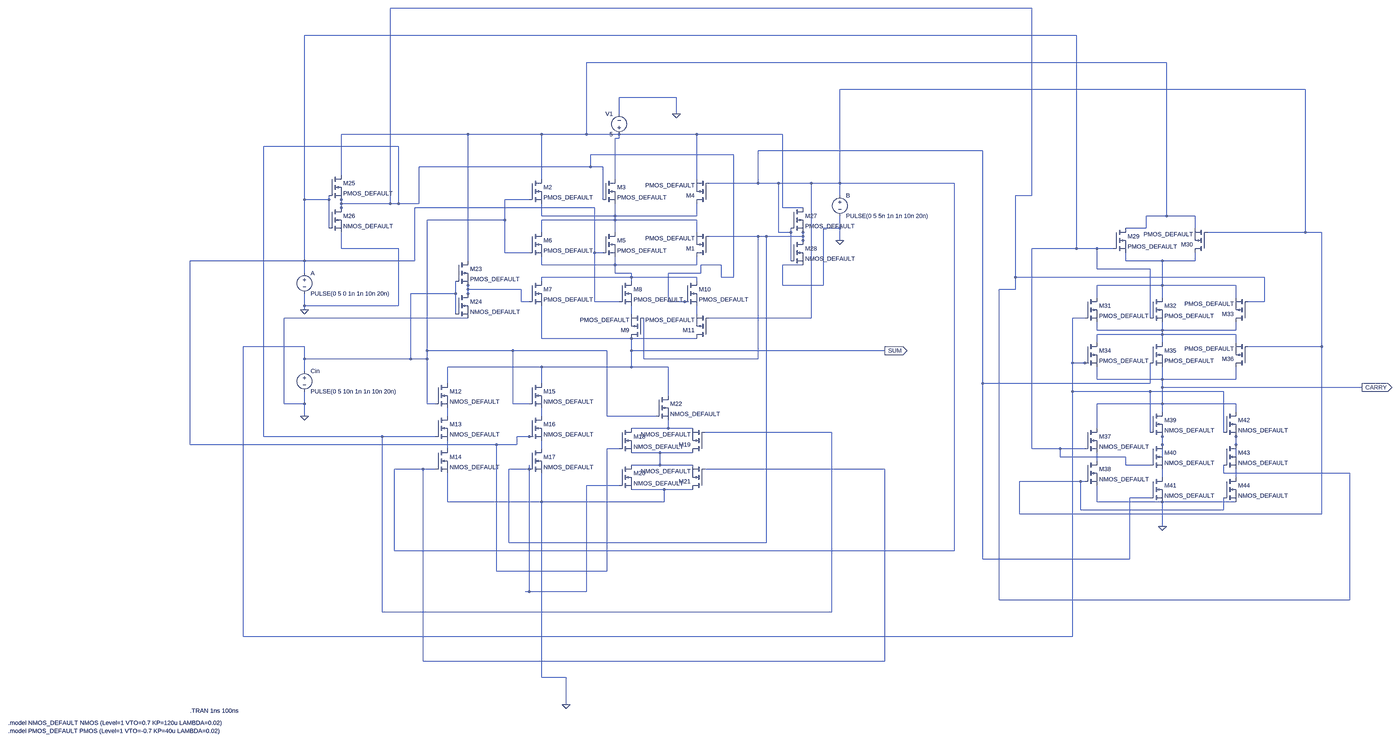
[diagram p0: schematic CMOS_FULL_ADDER.asc, whole sheet]
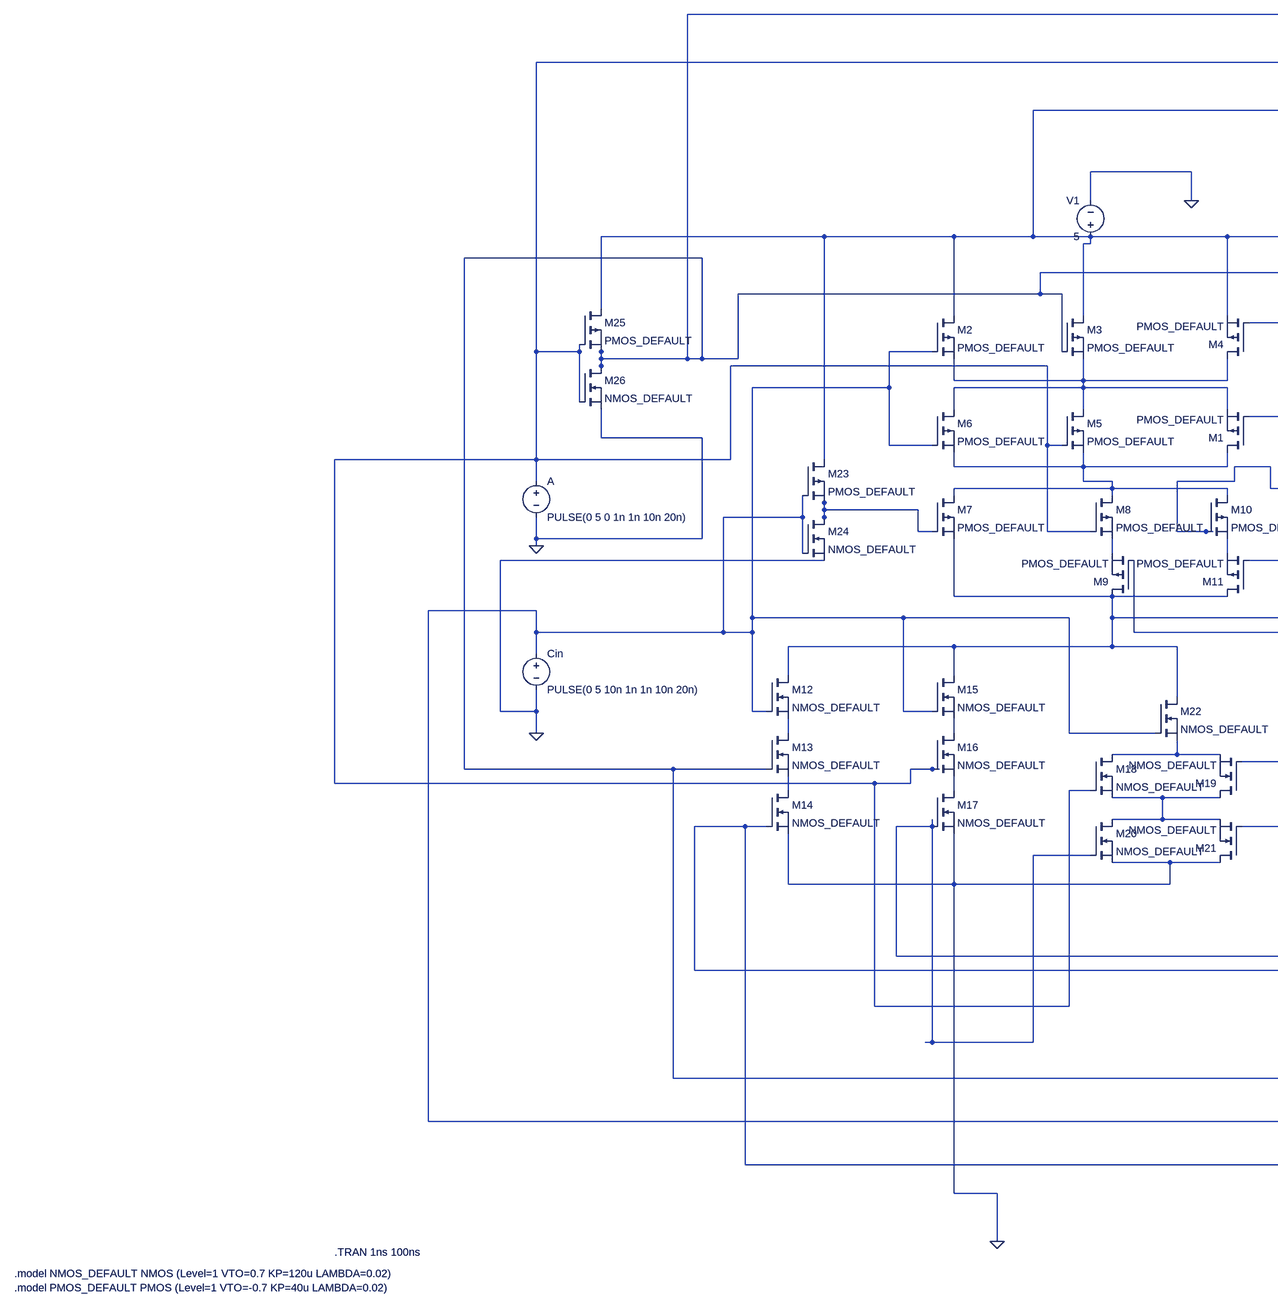
[diagram p1: schematic CMOS_FULL_ADDER.asc, part, row 1 of 1, column 1 of 2]
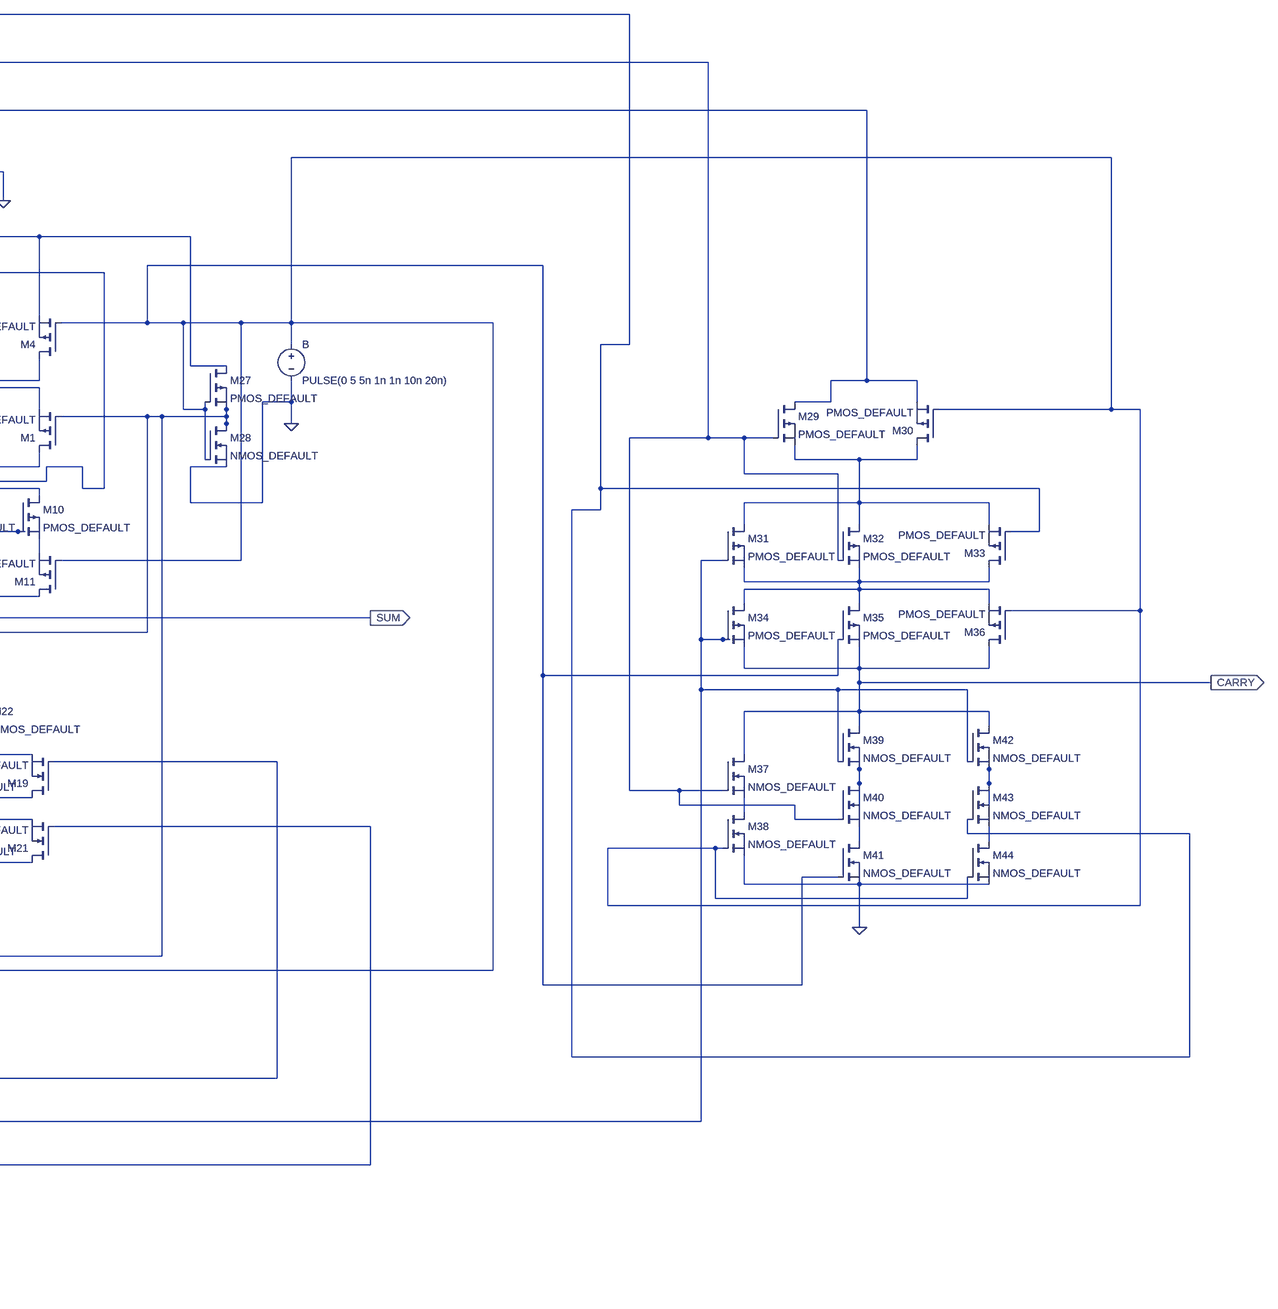
[diagram p2: schematic CMOS_FULL_ADDER.asc, part, row 1 of 1, column 2 of 2]
CMOS_FULL_ADDER.asc, the LTspice schematic file:
Version 4.1
SHEET 1 3260 1620
WIRE 1248 -1456 -1440 -1456
WIRE 1440 -1184 -1776 -1184
WIRE 1792 -1056 -672 -1056
WIRE 2336 -928 320 -928
WIRE -320 -896 -544 -896
WIRE -544 -832 -544 -896
WIRE -320 -832 -320 -896
WIRE -1136 -752 -1632 -752
WIRE -848 -752 -1136 -752
WIRE -672 -752 -672 -1056
WIRE -672 -752 -848 -752
WIRE -544 -752 -672 -752
WIRE -240 -752 -544 -752
WIRE 96 -752 -240 -752
WIRE -544 -736 -544 -752
WIRE -544 -736 -560 -736
WIRE -1408 -704 -1936 -704
WIRE 1056 -688 0 -688
WIRE -96 -672 -656 -672
WIRE -656 -624 -656 -672
WIRE -656 -624 -1328 -624
WIRE -608 -624 -656 -624
WIRE -1632 -592 -1632 -752
WIRE -848 -576 -848 -752
WIRE -560 -576 -560 -736
WIRE -240 -576 -240 -752
WIRE 0 -560 0 -688
WIRE 0 -560 -192 -560
WIRE 80 -560 0 -560
WIRE 208 -560 80 -560
WIRE 320 -560 320 -928
WIRE 320 -560 208 -560
WIRE 848 -560 320 -560
WIRE 320 -512 320 -560
WIRE 1248 -512 1248 -1456
WIRE 1248 -512 1184 -512
WIRE -1776 -496 -1776 -1184
WIRE -1680 -496 -1680 -512
WIRE -1680 -496 -1776 -496
WIRE -1632 -496 -1632 -512
WIRE -896 -496 -992 -496
WIRE -608 -496 -608 -624
WIRE -1632 -480 -1632 -496
WIRE -1440 -480 -1440 -1456
WIRE -1440 -480 -1632 -480
WIRE -1408 -480 -1408 -704
WIRE -1408 -480 -1440 -480
WIRE -1328 -480 -1328 -624
WIRE -1328 -480 -1408 -480
WIRE -1632 -464 -1632 -480
WIRE -640 -464 -1344 -464
WIRE 96 -464 96 -752
WIRE 176 -464 96 -464
WIRE -1632 -448 -1632 -464
WIRE -848 -432 -848 -480
WIRE -560 -432 -560 -480
WIRE -560 -432 -848 -432
WIRE -240 -432 -240 -480
WIRE -240 -432 -560 -432
WIRE 1792 -432 1792 -1056
WIRE 1792 -432 1712 -432
WIRE 1904 -432 1792 -432
WIRE -992 -416 -992 -496
WIRE -992 -416 -1296 -416
WIRE -560 -416 -560 -432
WIRE -560 -416 -848 -416
WIRE -240 -416 -560 -416
WIRE -1680 -384 -1680 -496
WIRE 320 -384 320 -432
WIRE 320 -384 256 -384
WIRE 1712 -384 1712 -432
WIRE 1712 -384 1632 -384
WIRE 1904 -384 1904 -432
WIRE -848 -368 -848 -416
WIRE -560 -368 -560 -416
WIRE -240 -368 -240 -416
WIRE 80 -368 80 -560
WIRE 128 -368 128 -384
WIRE 128 -368 80 -368
WIRE 176 -368 176 -384
WIRE 2336 -368 2336 -928
WIRE 2336 -368 1952 -368
WIRE 2400 -368 2336 -368
WIRE 0 -352 -192 -352
WIRE 32 -352 0 -352
WIRE 176 -352 176 -368
WIRE 176 -352 32 -352
WIRE 176 -336 176 -352
WIRE 320 -336 320 -384
WIRE 176 -320 176 -336
WIRE -1632 -304 -1632 -368
WIRE -1408 -304 -1632 -304
WIRE 1440 -304 1440 -1184
WIRE 1440 -304 1248 -304
WIRE 1520 -304 1440 -304
WIRE 1584 -304 1520 -304
WIRE -992 -288 -992 -416
WIRE -896 -288 -992 -288
WIRE -640 -288 -640 -464
WIRE -608 -288 -640 -288
WIRE -1776 -256 -1776 -496
WIRE -1776 -256 -2224 -256
WIRE -1344 -256 -1344 -464
WIRE -1344 -256 -1776 -256
WIRE -1136 -256 -1136 -752
WIRE 128 -256 128 -368
WIRE 1632 -256 1632 -288
WIRE 1776 -256 1632 -256
WIRE 1904 -256 1904 -288
WIRE 1904 -256 1776 -256
WIRE -848 -240 -848 -272
WIRE -560 -240 -560 -272
WIRE -560 -240 -848 -240
WIRE -240 -240 -240 -272
WIRE -240 -240 -560 -240
WIRE -144 -240 -224 -240
WIRE 176 -240 96 -240
WIRE 1520 -224 1520 -304
WIRE 1728 -224 1520 -224
WIRE -1776 -208 -1776 -256
WIRE -560 -208 -560 -240
WIRE -496 -208 -560 -208
WIRE -224 -208 -224 -240
WIRE -224 -208 -352 -208
WIRE -496 -192 -496 -208
WIRE -496 -192 -848 -192
WIRE -240 -192 -496 -192
WIRE -144 -192 -144 -240
WIRE -96 -192 -96 -672
WIRE -96 -192 -144 -192
WIRE 1184 -192 1184 -512
WIRE 2176 -192 1184 -192
WIRE -848 -176 -848 -192
WIRE -496 -176 -496 -192
WIRE -240 -176 -240 -192
WIRE -1136 -160 -1136 -176
WIRE 96 -160 96 -240
WIRE 256 -160 256 -384
WIRE 256 -160 96 -160
WIRE 1776 -160 1776 -256
WIRE 1776 -160 1520 -160
WIRE 2064 -160 1776 -160
WIRE -1136 -144 -1136 -160
WIRE -928 -144 -1136 -144
WIRE 1184 -144 1184 -192
WIRE 1184 -144 1120 -144
WIRE -1184 -128 -1184 -176
WIRE -1184 -128 -1360 -128
WIRE -1136 -128 -1136 -144
WIRE -1136 -112 -1136 -128
WIRE 1520 -112 1520 -160
WIRE 1776 -112 1776 -160
WIRE 2064 -112 2064 -160
WIRE -928 -96 -928 -144
WIRE -896 -96 -928 -96
WIRE -640 -96 -640 -288
WIRE -544 -96 -640 -96
WIRE -352 -96 -352 -208
WIRE -288 -96 -352 -96
WIRE -272 -96 -288 -96
WIRE 2176 -96 2176 -192
WIRE 2176 -96 2112 -96
WIRE -1776 -80 -1776 -128
WIRE -1408 -80 -1408 -304
WIRE -1408 -80 -1776 -80
WIRE -1776 -64 -1776 -80
WIRE -1184 -48 -1184 -128
WIRE -496 -48 -496 -80
WIRE -240 -48 -240 -80
WIRE -1136 -32 -1856 -32
WIRE 208 -32 208 -560
WIRE 208 -32 -192 -32
WIRE 1472 -32 1424 -32
WIRE 1728 -32 1728 -224
WIRE 1520 16 1520 -16
WIRE 1776 16 1776 -16
WIRE 1776 16 1520 16
WIRE 2064 16 2064 -16
WIRE 2064 16 1776 16
WIRE 1776 32 1776 16
WIRE 1776 32 1520 32
WIRE 2064 32 1776 32
WIRE -848 48 -848 -80
WIRE -496 48 -848 48
WIRE -240 48 -496 48
WIRE 1520 64 1520 32
WIRE 1776 64 1776 32
WIRE 2064 64 2064 32
WIRE -1776 80 -2016 80
WIRE 2400 80 2400 -368
WIRE 2400 80 2112 80
WIRE -1296 96 -1296 -416
WIRE -960 96 -1296 96
WIRE -592 96 -960 96
WIRE -496 96 -496 48
WIRE 496 96 -496 96
WIRE -1776 128 -1776 80
WIRE -1360 128 -1360 -128
WIRE -1360 128 -1776 128
WIRE -1296 128 -1296 96
WIRE -1296 128 -1360 128
WIRE -448 128 -448 -32
WIRE 0 128 0 -352
WIRE 0 128 -448 128
WIRE 1424 144 1424 -32
WIRE 1472 144 1424 144
WIRE 1488 144 1472 144
WIRE -848 160 -1216 160
WIRE -496 160 -496 96
WIRE -496 160 -848 160
WIRE -352 160 -496 160
WIRE -1776 176 -1776 128
WIRE 1520 208 1520 160
WIRE 1776 208 1776 160
WIRE 1776 208 1520 208
WIRE 2064 208 2064 160
WIRE 2064 208 1776 208
WIRE -1216 224 -1216 160
WIRE -848 224 -848 160
WIRE 1056 224 1056 -688
WIRE 1728 224 1728 144
WIRE 1728 224 1056 224
WIRE 1776 240 1776 208
WIRE 2576 240 1776 240
WIRE 1424 256 1424 144
WIRE 1728 256 1424 256
WIRE 2016 256 1728 256
WIRE -352 272 -352 160
WIRE -1856 304 -1856 -32
WIRE -1776 304 -1776 256
WIRE -1776 304 -1856 304
WIRE -1296 304 -1296 128
WIRE -1264 304 -1296 304
WIRE -960 304 -960 96
WIRE -896 304 -960 304
WIRE 1776 304 1776 240
WIRE 1776 304 1520 304
WIRE 2064 304 1776 304
WIRE 1776 336 1776 304
WIRE 2064 336 2064 304
WIRE -1776 352 -1776 304
WIRE -1216 352 -1216 320
WIRE -848 352 -848 320
WIRE -592 352 -592 96
WIRE -400 352 -592 352
WIRE -352 400 -352 368
WIRE -352 400 -496 400
WIRE -256 400 -352 400
WIRE 1520 400 1520 304
WIRE 288 416 -208 416
WIRE 1728 416 1728 256
WIRE 2016 416 2016 256
WIRE -1936 432 -1936 -704
WIRE -1472 432 -1936 432
WIRE -1264 432 -1472 432
WIRE -896 432 -944 432
WIRE -880 432 -896 432
WIRE 1776 432 1776 416
WIRE 2064 432 2064 416
WIRE -2224 464 -2224 -256
WIRE -1024 464 -2224 464
WIRE -944 464 -944 432
WIRE -944 464 -1024 464
WIRE 1776 464 1776 432
WIRE 2064 464 2064 432
WIRE -1216 480 -1216 448
WIRE -848 480 -848 448
WIRE -544 480 -592 480
WIRE 1248 480 1248 -304
WIRE 1376 480 1248 480
WIRE 1472 480 1376 480
WIRE -384 496 -496 496
WIRE -256 496 -384 496
WIRE 1376 512 1376 480
WIRE 1632 512 1376 512
WIRE 1520 528 1520 496
WIRE -384 544 -384 496
WIRE -384 544 -496 544
WIRE -256 544 -384 544
WIRE 1632 544 1632 512
WIRE 1728 544 1632 544
WIRE 1776 544 1776 464
WIRE 2064 544 2064 464
WIRE -1312 560 -1424 560
WIRE -1264 560 -1312 560
WIRE -896 560 -896 544
WIRE -896 560 -976 560
WIRE 496 560 -208 560
WIRE 2016 576 2016 544
WIRE 2528 576 2016 576
WIRE 1776 592 1776 560
WIRE 2064 592 2064 560
WIRE 1456 608 1200 608
WIRE 1472 608 1456 608
WIRE -544 624 -672 624
WIRE -368 640 -496 640
WIRE -256 640 -368 640
WIRE 1728 672 1648 672
WIRE -1216 688 -1216 576
WIRE -848 688 -848 576
WIRE -848 688 -1216 688
WIRE -368 688 -368 640
WIRE -368 688 -848 688
WIRE 1520 688 1520 624
WIRE 1776 688 1520 688
WIRE 2064 688 1776 688
WIRE 1456 720 1456 608
WIRE 2016 720 2016 672
WIRE 2016 720 1456 720
WIRE 1200 736 1200 608
WIRE 2400 736 2400 80
WIRE 2400 736 1200 736
WIRE 1776 784 1776 688
WIRE -976 848 -976 560
WIRE 32 848 32 -352
WIRE 32 848 -976 848
WIRE -1424 880 -1424 560
WIRE 848 880 848 -560
WIRE 848 880 -1424 880
WIRE 1056 912 1056 224
WIRE 1648 912 1648 672
WIRE 1648 912 1056 912
WIRE -1024 960 -1024 464
WIRE -592 960 -592 480
WIRE -592 960 -1024 960
WIRE -896 1040 -896 560
WIRE -896 1040 -912 1040
WIRE -672 1040 -672 624
WIRE -672 1040 -896 1040
WIRE 1120 1072 1120 -144
WIRE 2528 1072 2528 576
WIRE 2528 1072 1120 1072
WIRE -1472 1120 -1472 432
WIRE 288 1120 288 416
WIRE 288 1120 -1472 1120
WIRE -2016 1216 -2016 80
WIRE 1424 1216 1424 256
WIRE 1424 1216 -2016 1216
WIRE -1312 1312 -1312 560
WIRE 496 1312 496 560
WIRE 496 1312 -1312 1312
WIRE -848 1376 -848 688
WIRE -752 1376 -848 1376
WIRE -752 1504 -752 1376
FLAG -1776 352 0
FLAG -1776 -64 0
FLAG 320 -336 0
FLAG -320 -832 0
FLAG -752 1504 0
FLAG 496 96 SUM
IOPIN 496 96 Out
FLAG 2576 240 CARRY
IOPIN 2576 240 Out
FLAG 1776 784 0
SYMBOL pmos -896 -576 R0
SYMATTR InstName M2
SYMATTR Value PMOS_DEFAULT
SYMBOL pmos -608 -576 R0
SYMATTR InstName M3
SYMATTR Value PMOS_DEFAULT
SYMBOL pmos -192 -480 R180
SYMATTR InstName M4
SYMATTR Value PMOS_DEFAULT
SYMBOL pmos -192 -272 R180
SYMATTR InstName M1
SYMATTR Value PMOS_DEFAULT
SYMBOL pmos -608 -368 R0
SYMATTR InstName M5
SYMATTR Value PMOS_DEFAULT
SYMBOL pmos -896 -368 R0
SYMATTR InstName M6
SYMATTR Value PMOS_DEFAULT
SYMBOL voltage -544 -736 R180
WINDOW 0 24 96 Left 2
WINDOW 3 24 16 Left 2
WINDOW 123 0 0 Left 0
WINDOW 39 0 0 Left 0
SYMATTR InstName V1
SYMATTR Value 5
SYMBOL pmos -896 -176 R0
SYMATTR InstName M7
SYMATTR Value PMOS_DEFAULT
SYMBOL pmos -544 -176 R0
SYMATTR InstName M8
SYMATTR Value PMOS_DEFAULT
SYMBOL pmos -448 48 R180
SYMATTR InstName M9
SYMATTR Value PMOS_DEFAULT
SYMBOL pmos -288 -176 R0
SYMATTR InstName M10
SYMATTR Value PMOS_DEFAULT
SYMBOL pmos -192 48 R180
SYMATTR InstName M11
SYMATTR Value PMOS_DEFAULT
SYMBOL nmos -1264 224 R0
SYMATTR InstName M12
SYMATTR Value NMOS_DEFAULT
SYMBOL nmos -1264 352 R0
SYMATTR InstName M13
SYMATTR Value NMOS_DEFAULT
SYMBOL nmos -1264 480 R0
SYMATTR InstName M14
SYMATTR Value NMOS_DEFAULT
SYMBOL nmos -896 224 R0
SYMATTR InstName M15
SYMATTR Value NMOS_DEFAULT
SYMBOL nmos -896 352 R0
SYMATTR InstName M16
SYMATTR Value NMOS_DEFAULT
SYMBOL nmos -896 480 R0
SYMATTR InstName M17
SYMATTR Value NMOS_DEFAULT
SYMBOL nmos -544 400 R0
SYMATTR InstName M18
SYMATTR Value NMOS_DEFAULT
SYMBOL nmos -208 496 R180
SYMATTR InstName M19
SYMATTR Value NMOS_DEFAULT
SYMBOL nmos -544 544 R0
SYMATTR InstName M20
SYMATTR Value NMOS_DEFAULT
SYMBOL nmos -208 640 R180
SYMATTR InstName M21
SYMATTR Value NMOS_DEFAULT
SYMBOL nmos -400 272 R0
SYMATTR InstName M22
SYMATTR Value NMOS_DEFAULT
SYMBOL voltage -1776 -224 R0
WINDOW 123 0 0 Left 0
WINDOW 39 0 0 Left 0
SYMATTR InstName A
SYMATTR Value PULSE(0 5 0 1n 1n 10n 20n)
SYMBOL voltage 320 -528 R0
WINDOW 123 0 0 Left 0
WINDOW 39 0 0 Left 0
SYMATTR InstName B
SYMATTR Value PULSE(0 5 5n 1n 1n 10n 20n)
SYMBOL voltage -1776 160 R0
WINDOW 123 0 0 Left 0
WINDOW 39 0 0 Left 0
SYMATTR InstName Cin
SYMATTR Value PULSE(0 5 10n 1n 1n 10n 20n)
SYMBOL pmos -1184 -256 R0
SYMATTR InstName M23
SYMATTR Value PMOS_DEFAULT
SYMBOL nmos -1184 -128 R0
SYMATTR InstName M24
SYMATTR Value NMOS_DEFAULT
SYMBOL pmos -1680 -592 R0
SYMATTR InstName M25
SYMATTR Value PMOS_DEFAULT
SYMBOL nmos -1680 -464 R0
SYMATTR InstName M26
SYMATTR Value NMOS_DEFAULT
SYMBOL pmos 128 -464 R0
SYMATTR InstName M27
SYMATTR Value PMOS_DEFAULT
SYMBOL nmos 128 -336 R0
SYMATTR InstName M28
SYMATTR Value NMOS_DEFAULT
SYMBOL pmos 1584 -384 R0
SYMATTR InstName M29
SYMATTR Value PMOS_DEFAULT
SYMBOL pmos 1952 -288 R180
SYMATTR InstName M30
SYMATTR Value PMOS_DEFAULT
SYMBOL pmos 1472 -112 R0
SYMATTR InstName M31
SYMATTR Value PMOS_DEFAULT
SYMBOL pmos 1728 -112 R0
SYMATTR InstName M32
SYMATTR Value PMOS_DEFAULT
SYMBOL pmos 2112 -16 R180
SYMATTR InstName M33
SYMATTR Value PMOS_DEFAULT
SYMBOL pmos 1472 64 R0
SYMATTR InstName M34
SYMATTR Value PMOS_DEFAULT
SYMBOL pmos 1728 64 R0
SYMATTR InstName M35
SYMATTR Value PMOS_DEFAULT
SYMBOL pmos 2112 160 R180
SYMATTR InstName M36
SYMATTR Value PMOS_DEFAULT
SYMBOL nmos 1472 400 R0
SYMATTR InstName M37
SYMATTR Value NMOS_DEFAULT
SYMBOL nmos 1472 528 R0
SYMATTR InstName M38
SYMATTR Value NMOS_DEFAULT
SYMBOL nmos 1728 336 R0
SYMATTR InstName M39
SYMATTR Value NMOS_DEFAULT
SYMBOL nmos 1728 464 R0
SYMATTR InstName M40
SYMATTR Value NMOS_DEFAULT
SYMBOL nmos 1728 592 R0
SYMATTR InstName M41
SYMATTR Value NMOS_DEFAULT
SYMBOL nmos 2016 336 R0
SYMATTR InstName M42
SYMATTR Value NMOS_DEFAULT
SYMBOL nmos 2016 464 R0
SYMATTR InstName M43
SYMATTR Value NMOS_DEFAULT
SYMBOL nmos 2016 592 R0
SYMATTR InstName M44
SYMATTR Value NMOS_DEFAULT
TEXT -2936 1576 Left 2 !.model NMOS_DEFAULT NMOS (Level=1 VTO=0.7 KP=120u LAMBDA=0.02)\n.model PMOS_DEFAULT PMOS (Level=1 VTO=-0.7 KP=40u LAMBDA=0.02)
TEXT -2224 1528 Left 2 !.TRAN 1ns 100ns

The netlist it stands for:
* CMOS_FULL_ADDER.asc
M2 N003 N005 N006 N006 PMOS_DEFAULT
M3 N003 N001 N006 N006 PMOS_DEFAULT
M4 N006 N004 N003 N003 PMOS_DEFAULT
M1 N009 N007 N006 N006 PMOS_DEFAULT
M5 N006 N002 N009 N009 PMOS_DEFAULT
M6 N006 N005 N009 N009 PMOS_DEFAULT
V1 N003 0 5
M7 N009 N010 SUM SUM PMOS_DEFAULT
M8 N009 N002 N011 N011 PMOS_DEFAULT
M9 SUM N007 N011 N011 PMOS_DEFAULT
M10 N009 N001 N012 N012 PMOS_DEFAULT
M11 SUM N004 N012 N012 PMOS_DEFAULT
M12 SUM N005 N014 N014 NMOS_DEFAULT
M13 N014 N001 N019 N019 NMOS_DEFAULT
M14 N019 N004 0 0 NMOS_DEFAULT
M15 SUM N005 N015 N015 NMOS_DEFAULT
M16 N015 N002 N020 N020 NMOS_DEFAULT
M17 N020 N007 0 0 NMOS_DEFAULT
M18 N016 N002 N021 N021 NMOS_DEFAULT
M19 N021 N001 N016 N016 NMOS_DEFAULT
M20 N021 N007 0 0 NMOS_DEFAULT
M21 0 N004 N021 N021 NMOS_DEFAULT
M22 SUM N005 N016 N016 NMOS_DEFAULT
V§A N002 0 PULSE(0 5 0 1n 1n 10n 20n)
V§B N004 0 PULSE(0 5 5n 1n 1n 10n 20n)
V§Cin N005 0 PULSE(0 5 10n 1n 1n 10n 20n)
M23 N003 N005 N010 N010 PMOS_DEFAULT
M24 N010 N005 0 0 NMOS_DEFAULT
M25 N003 N002 N001 N001 PMOS_DEFAULT
M26 N001 N002 0 0 NMOS_DEFAULT
M27 N003 N004 N007 N007 PMOS_DEFAULT
M28 N007 N004 0 0 NMOS_DEFAULT
M29 N003 N002 N008 N008 PMOS_DEFAULT
M30 N008 N004 N003 N003 PMOS_DEFAULT
M31 N008 N005 N013 N013 PMOS_DEFAULT
M32 N008 N002 N013 N013 PMOS_DEFAULT
M33 N013 N001 N008 N008 PMOS_DEFAULT
M34 N013 N005 CARRY CARRY PMOS_DEFAULT
M35 N013 N004 CARRY CARRY PMOS_DEFAULT
M36 CARRY N004 N013 N013 PMOS_DEFAULT
M37 CARRY N002 N022 N022 NMOS_DEFAULT
M38 N022 N004 0 0 NMOS_DEFAULT
M39 CARRY N005 N017 N017 NMOS_DEFAULT
M40 N017 N002 N023 N023 NMOS_DEFAULT
M41 N023 N004 0 0 NMOS_DEFAULT
M42 CARRY N005 N018 N018 NMOS_DEFAULT
M43 N018 N001 N024 N024 NMOS_DEFAULT
M44 N024 N004 0 0 NMOS_DEFAULT
.model NMOS NMOS
.model PMOS PMOS
.lib standard.mos
.model NMOS_DEFAULT NMOS (Level=1 VTO=0.7 KP=120u LAMBDA=0.02)
.model PMOS_DEFAULT PMOS (Level=1 VTO=-0.7 KP=40u LAMBDA=0.02)
.TRAN 1ns 100ns
.backanno
.end